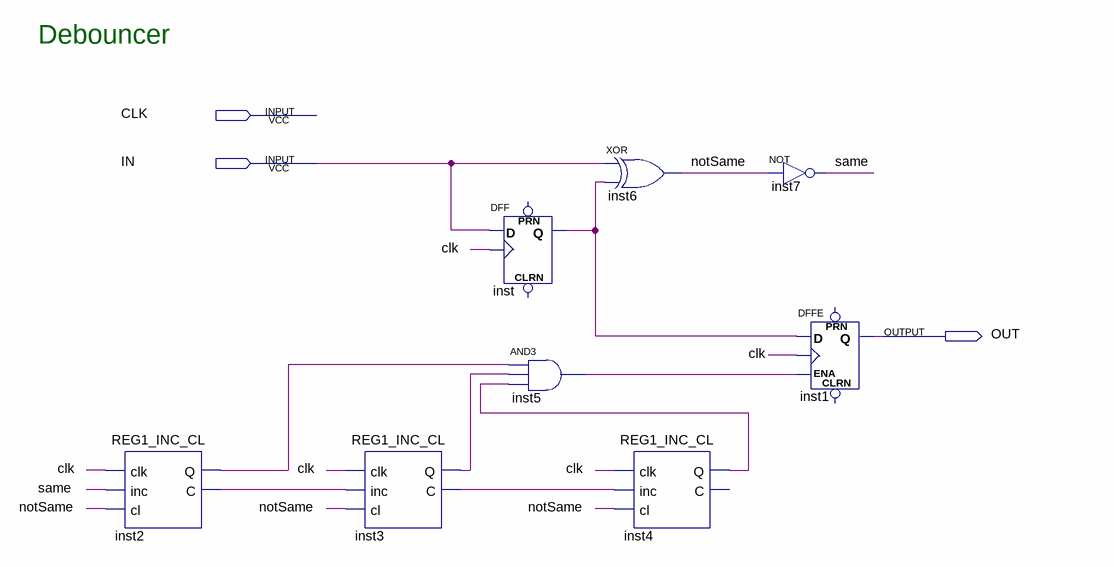
[diagram p0: schematic sheet]
// Quartus schematic Debouncer.bdf as structural Verilog: 8 symbols, 3 pins
module Debouncer (
  input  CLK,
  input  IN,
  output OUT
);

  wire inst2_c, inst2_q, inst3_c, inst3_q, inst4_q, inst5_out, inst_q, notSame, same;

  REG1_INC_CL inst2 (.clk(CLK), .inc(same), .cl(notSame), .Q(inst2_q), .C(inst2_c));
  REG1_INC_CL inst3 (.clk(CLK), .inc(inst2_c), .cl(notSame), .Q(inst3_q), .C(inst3_c));
  DFF inst (.CLK(CLK), .D(IN), .Q(inst_q));  // open: CLRN, PRN
  and inst5 (inst5_out, inst2_q, inst3_q, inst4_q);
  xor inst6 (notSame, IN, inst_q);
  REG1_INC_CL inst4 (.clk(CLK), .inc(inst3_c), .cl(notSame), .Q(inst4_q));  // open: C
  not inst7 (same, notSame);
  DFFE inst1 (.D(inst_q), .CLK(CLK), .ENA(inst5_out), .Q(OUT));  // open: PRN, CLRN

  // Notes on the sheet:
  //   Debouncer
endmodule
